# EAGLE design power-v3 (EAGLE 5.11)
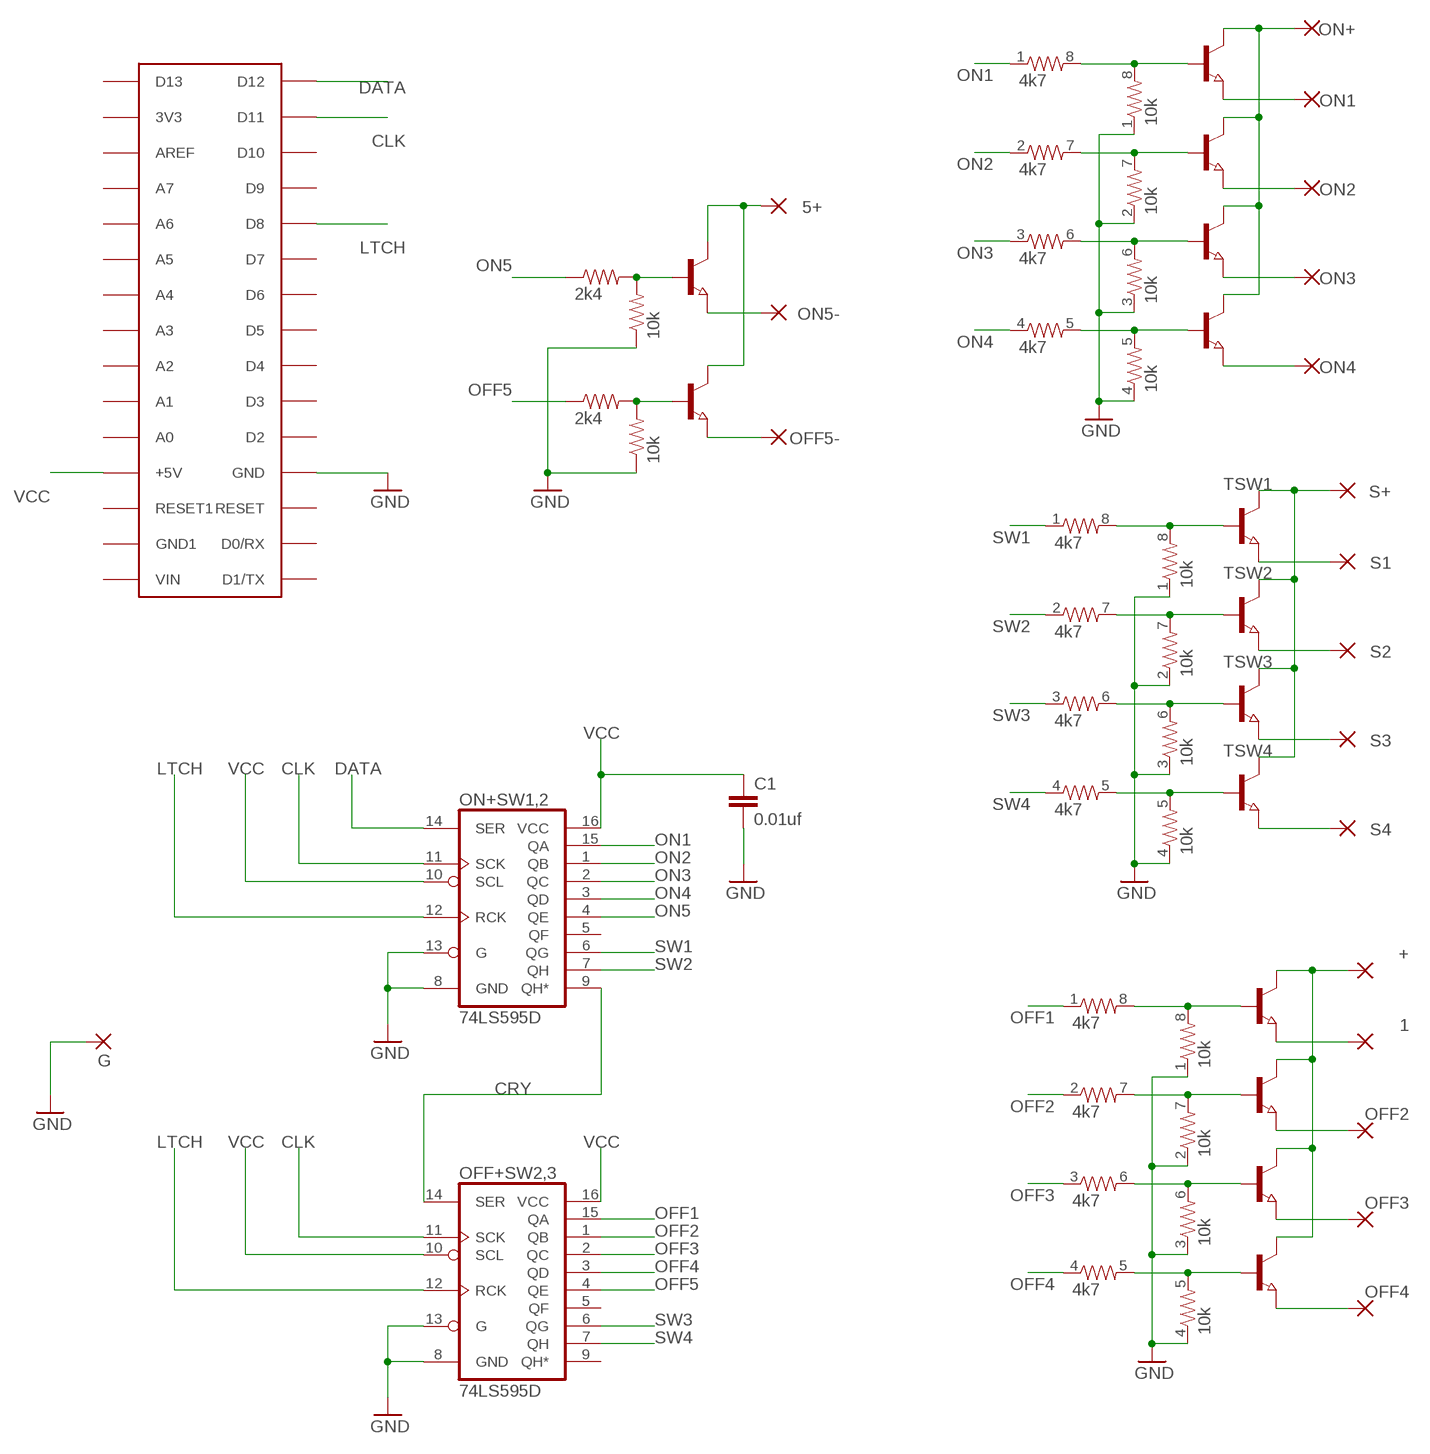
[diagram p0: schematic, sheet 1]

## Parts
1  1,6/0,8  [1,6/0,8]
5+  1,6/0,8  [1,6/0,8]
+  1,6/0,8  [1,6/0,8]
C1  0.01uf  CAP0603-CAP  [0603-CAP]
G  1,6/0,8  [1,6/0,8]
NANO  ARDUINONANO  [PDIP-32]
OFF2  1,6/0,8  [1,6/0,8]
OFF3  1,6/0,8  [1,6/0,8]
OFF4  1,6/0,8  [1,6/0,8]
OFF5-  1,6/0,8  [1,6/0,8]
OFF+SW2,3  74LS595D  [SO16]
ON1  1,6/0,8  [1,6/0,8]
ON2  1,6/0,8  [1,6/0,8]
ON3  1,6/0,8  [1,6/0,8]
ON4  1,6/0,8  [1,6/0,8]
ON5-  1,6/0,8  [1,6/0,8]
ON+  1,6/0,8  [1,6/0,8]
ON+SW1,2  74LS595D  [SO16]
R1  4k7  RESISTOR-ARRAY0603-ARV  [0603-ARV]
R2  10k  RESISTOR-ARRAY0603-ARV  [0603-ARV]
R3  2k4  RESISTOR0603-RES  [0603-RES]
R18  2k4  RESISTOR0603-RES  [0603-RES]
R19  10k  RESISTOR0603-RES  [0603-RES]
R20  10k  RESISTOR0603-RES  [0603-RES]
R21  4k7  RESISTOR-ARRAY0603-ARV  [0603-ARV]
R22  10k  RESISTOR-ARRAY0603-ARV  [0603-ARV]
R23  4k7  RESISTOR-ARRAY0603-ARV  [0603-ARV]
R24  10k  RESISTOR-ARRAY0603-ARV  [0603-ARV]
S1  1,6/0,8  [1,6/0,8]
S2  1,6/0,8  [1,6/0,8]
S3  1,6/0,8  [1,6/0,8]
S4  1,6/0,8  [1,6/0,8]
S+  1,6/0,8  [1,6/0,8]
TOFF1  NPN-TRANSISTOR_SOT23  [SOT23]
TOFF2  NPN-TRANSISTOR_SOT23  [SOT23]
TOFF3  NPN-TRANSISTOR_SOT23  [SOT23]
TOFF4  NPN-TRANSISTOR_SOT23  [SOT23]
TOFF5  NPN-TRANSISTOR_SOT23  [SOT23]
TON1  NPN-TRANSISTOR_SOT23  [SOT23]
TON2  NPN-TRANSISTOR_SOT23  [SOT23]
TON3  NPN-TRANSISTOR_SOT23  [SOT23]
TON4  NPN-TRANSISTOR_SOT23  [SOT23]
TON5  NPN-TRANSISTOR_SOT23  [SOT23]
TSW1  NPN-TRANSISTOR_SOT23  [SOT23]
TSW2  NPN-TRANSISTOR_SOT23  [SOT23]
TSW3  NPN-TRANSISTOR_SOT23  [SOT23]
TSW4  NPN-TRANSISTOR_SOT23  [SOT23]

## Nets
CLK: NANO.D11 OFF+SW2,3.11(SCK) ON+SW1,2.11(SCK)
CRY: OFF+SW2,3.14(SER) ON+SW1,2.9(QH*)
DATA: NANO.D12 ON+SW1,2.14(SER)
GND: C1.2 G.1(P) NANO.GND OFF+SW2,3.8(GND) OFF+SW2,3.13(G) ON+SW1,2.8(GND) ON+SW1,2.13(G) R2.1 R2.2 R2.3 R2.4 R19.1 R20.1 R22.1 R22.2 R22.3 R22.4 R24.1 R24.2 R24.3 R24.4
LTCH: NANO.D8 OFF+SW2,3.12(RCK) ON+SW1,2.12(RCK)
N$1: +.1(P) TOFF1.3(C) TOFF2.3(C) TOFF3.3(C) TOFF4.3(C)
N$2: 1.1(P) TOFF1.2(E)
N$3: OFF2.1(P) TOFF2.2(E)
N$4: OFF3.1(P) TOFF3.2(E)
N$5: 5+.1(P) TOFF5.3(C) TON5.3(C)
N$6: OFF4.1(P) TOFF4.2(E)
N$7: S+.1(P) TSW1.3(C) TSW2.3(C) TSW3.3(C) TSW4.3(C)
N$8: S1.1(P) TSW1.2(E)
N$9: S2.1(P) TSW2.2(E)
N$10: S3.1(P) TSW3.2(E)
N$11: ON5-.1(P) TON5.2(E)
N$12: S4.1(P) TSW4.2(E)
N$23: ON+.1(P) TON1.3(C) TON2.3(C) TON3.3(C) TON4.3(C)
N$24: ON1.1(P) TON1.2(E)
N$25: ON2.1(P) TON2.2(E)
N$29: ON3.1(P) TON3.2(E)
N$30: ON4.1(P) TON4.2(E)
N$31: OFF5-.1(P) TOFF5.2(E)
OFF1: OFF+SW2,3.15(QA) R1.1
OFF2: OFF+SW2,3.1(QB) R1.2
OFF3: OFF+SW2,3.2(QC) R1.3
OFF4: OFF+SW2,3.3(QD) R1.4
OFF5: OFF+SW2,3.4(QE) R18.1 R18.2 R20.2 TOFF5.1(B)
ON1: ON+SW1,2.15(QA) R23.1
ON2: ON+SW1,2.1(QB) R23.2
ON3: ON+SW1,2.2(QC) R23.3
ON4: ON+SW1,2.3(QD) R23.4
ON5: ON+SW1,2.4(QE) R3.1 R3.2 R19.2 TON5.1(B)
SW1: ON+SW1,2.6(QG) R1.8 R2.8 R21.1 R21.8 R22.8 R23.8 R24.8 TOFF1.1(B) TON1.1(B) TSW1.1(B)
SW2: ON+SW1,2.7(QH) R1.7 R2.7 R21.2 R21.7 R22.7 R23.7 R24.7 TOFF2.1(B) TON2.1(B) TSW2.1(B)
SW3: OFF+SW2,3.6(QG) R1.6 R2.6 R21.3 R21.6 R22.6 R23.6 R24.6 TOFF3.1(B) TON3.1(B) TSW3.1(B)
SW4: OFF+SW2,3.7(QH) R1.5 R2.5 R21.4 R21.5 R22.5 R23.5 R24.5 TOFF4.1(B) TON4.1(B) TSW4.1(B)
VCC: C1.1 NANO.+5V OFF+SW2,3.10(SCL) OFF+SW2,3.16(VCC) ON+SW1,2.10(SCL) ON+SW1,2.16(VCC)
Unconnected: NANO.3V3 NANO.A0 NANO.A1 NANO.A2 NANO.A3 NANO.A4 NANO.A5 NANO.A6 NANO.A7 NANO.AREF NANO.D0/RX NANO.D1/TX NANO.D2 NANO.D3 NANO.D4 NANO.D5 NANO.D6 NANO.D7 NANO.D9 NANO.D10 NANO.D13 NANO.GND1 NANO.RESET NANO.RESET1 NANO.VIN OFF+SW2,3.5(QF) OFF+SW2,3.9(QH*) ON+SW1,2.5(QF)

## Library data of the parts
1 5+ + G OFF2-OFF4 OFF5- ON1-ON4 ON5- ON+ S1-S4 S+ = wirepad:1,6/0,8: THROUGH-HOLE PAD
C1 = SparkFun:CAP: Capacitor Standard 0603 ceramic capacitor, and 0.1" leaded capacitor.
NANO = MyNano:ARDUINONANO
OFF+SW2,3 ON+SW1,2 = SparkFun:74*595: 8-bit SHIFT REGISTER, output latch
R1 R2 R21-R24 = SparkFun:RESISTOR-ARRAY: Array Chip Resistor Source: RS Component / Phycomp
R3 R18-R20 = SparkFun:RESISTOR: Resistor Basic schematic elements and footprints for 0603, 1206, and PTH resistors.
TOFF1-TOFF5 TON1-TON5 TSW1-TSW4 = semicon-smd-ipc:NPN-TRANSISTOR_: NPN TRANSISTOR

## Net classes
0 default: width 0.305 mm, clearance 0.305 mm

## Board
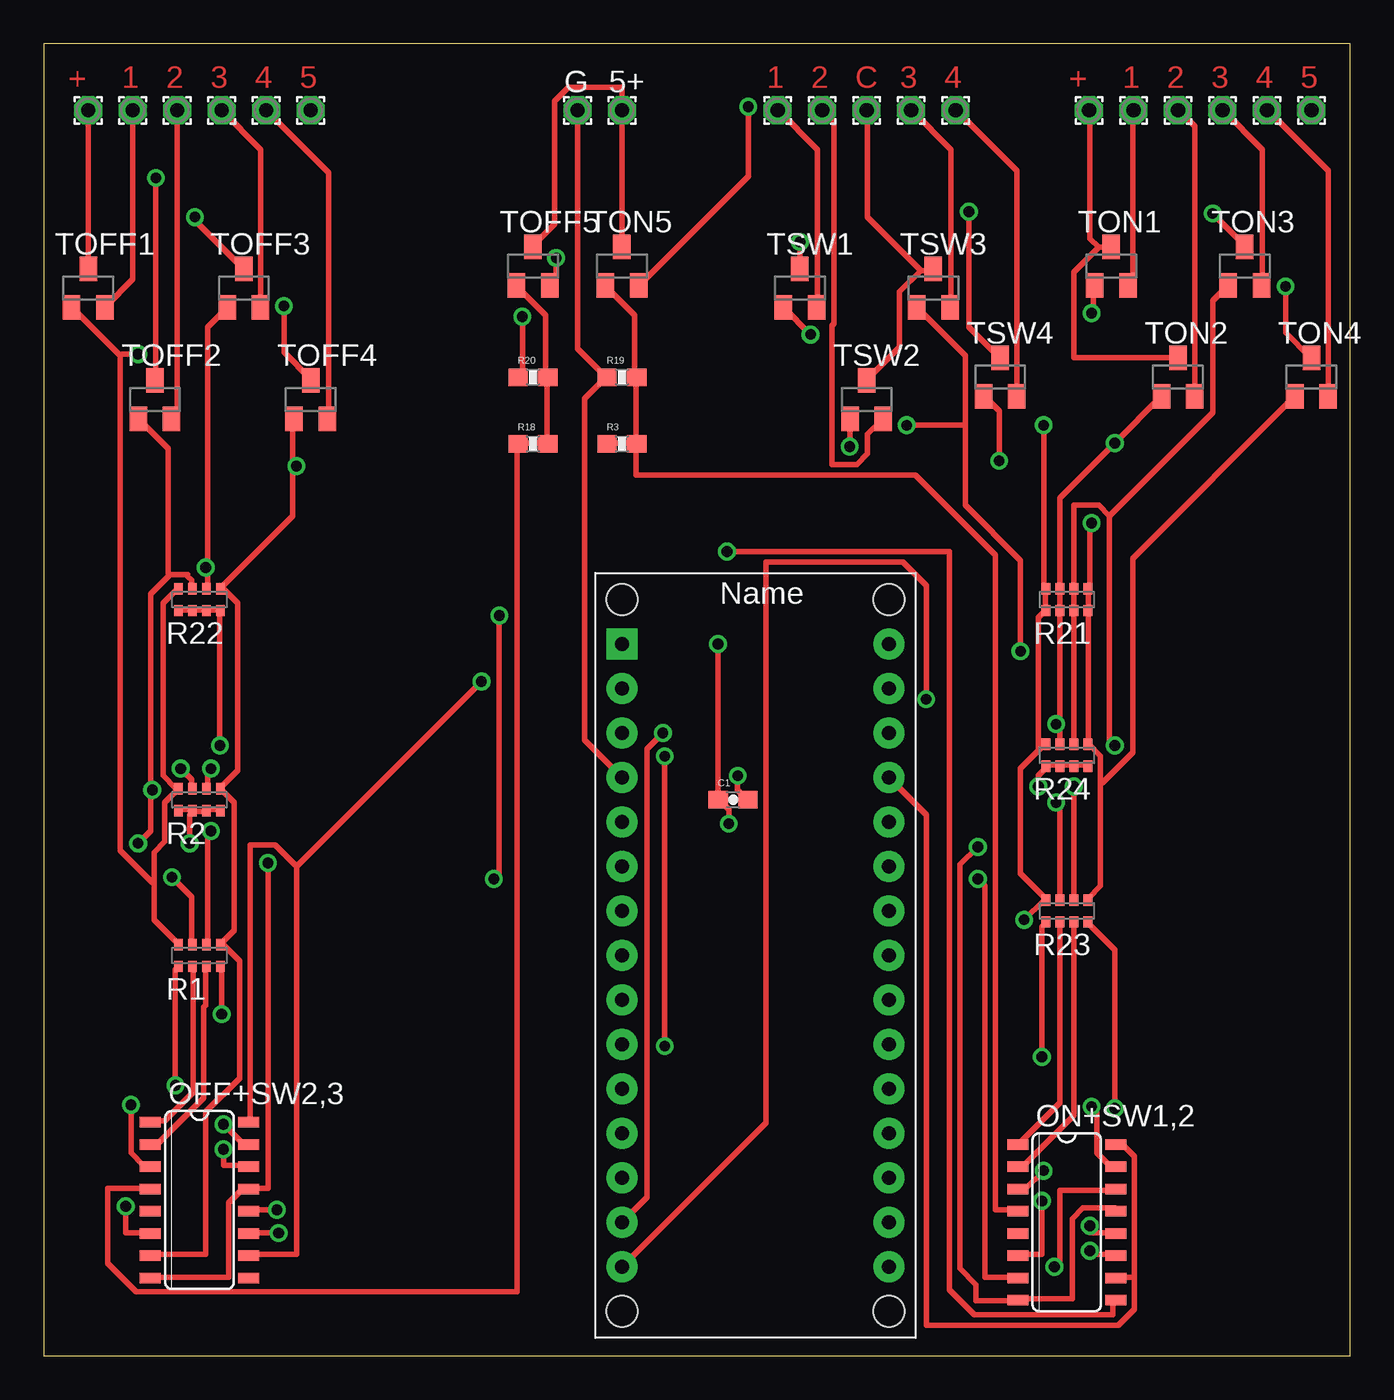
[diagram p1: board, top side]
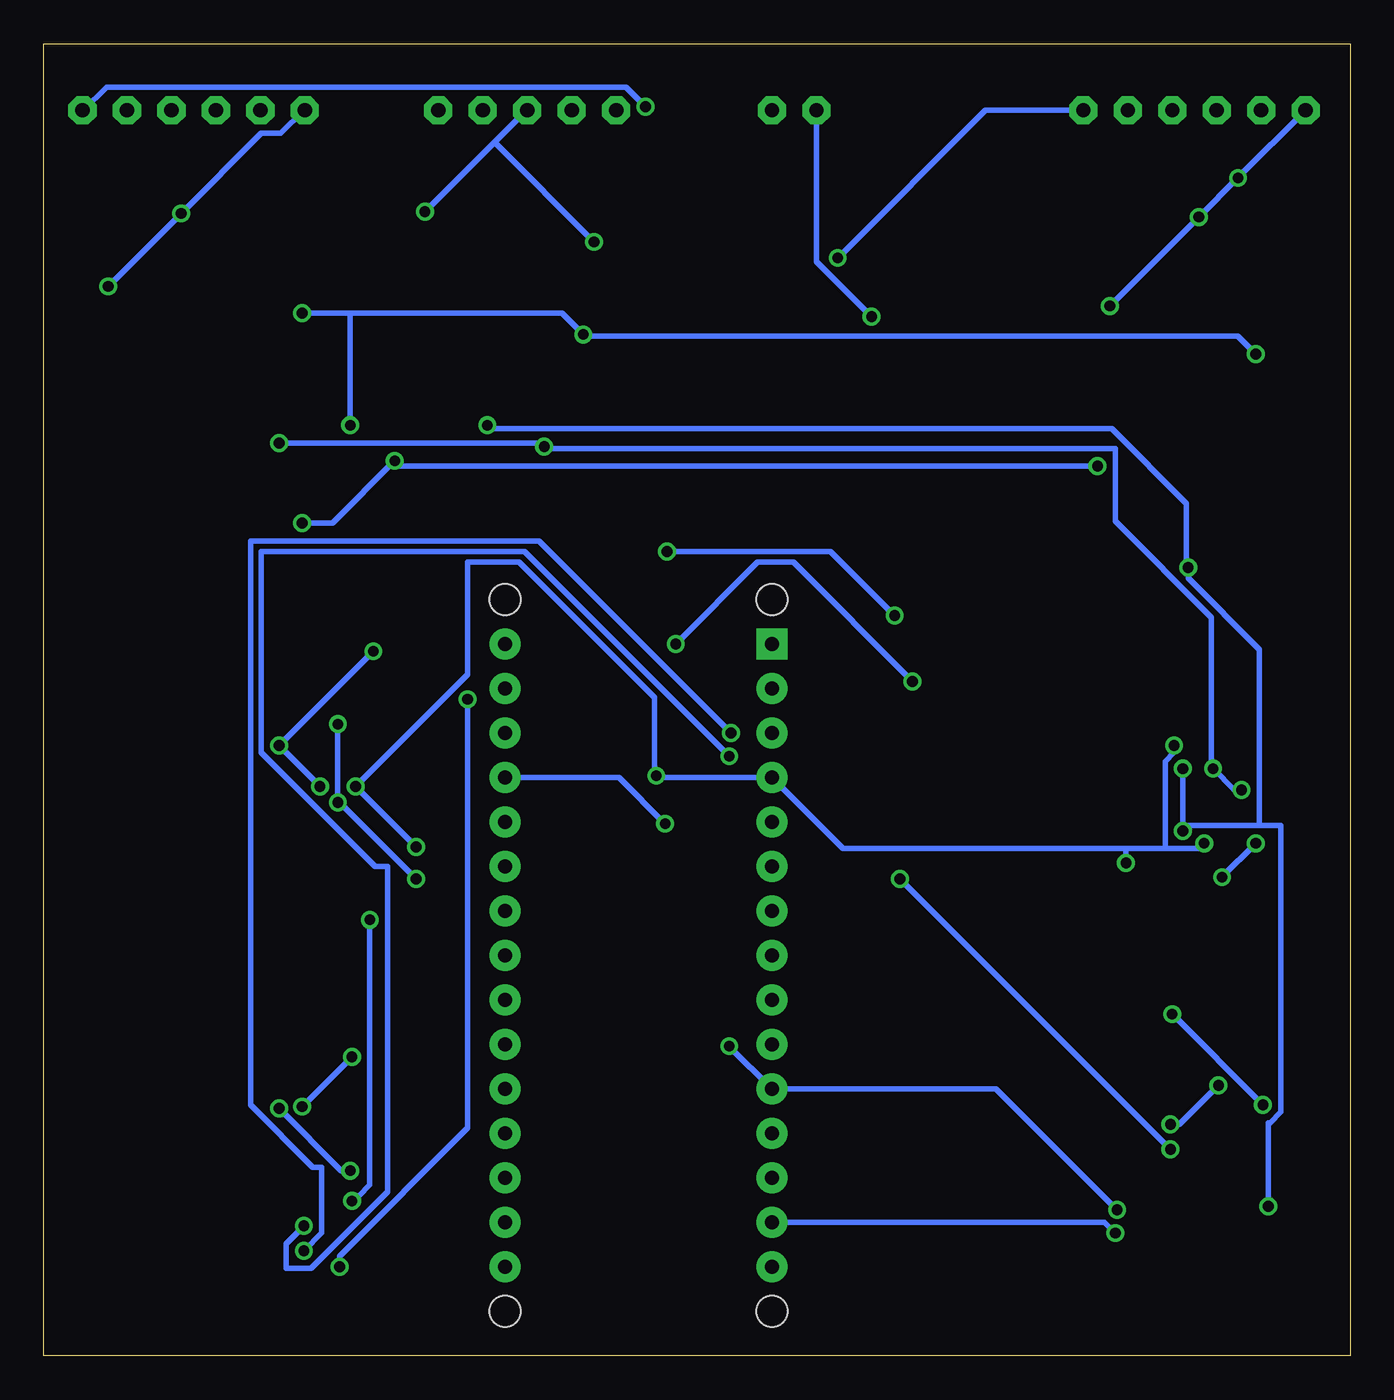
[diagram p2: board, bottom side, seen from below]

Size 74.6 x 74.92 mm. Coordinates in mm from the lower left corner, seen from the top.
Outline: 0,0 74.6,0 74.6,74.92 0,74.92 0,0
Copper layers (1*16): Top 0.035mm / dielectric 1.5mm / Bottom 0.035mm
Design rules "default": minimum track width 10mil, minimum drill 24mil, track to track 8mil, track to pad 8mil, pad to pad 8mil, via to via 8mil, smd to smd 8mil, copper to edge 40mil, drill to drill 8mil, minimum pad ring 10mil, minimum via ring 8mil, stop-mask expansion 4mil, vias tented up to drill 0mil, thermal gap 10mil

### Footprints (pad centres in the part's own frame; a part is rotated, then mirrored left to right if it is on the bottom)
1,6/0,8 = drill 0.813 pad 1.6 octagon: 1 0,0
0603-CAP = smd 1.1 x 1: 1 -0.85,0; 2 0.85,0
PDIP-32 = drill 0.8 pad 1.778 round: 3V3 15.24,-35.56; +5V 15.24,-10.16; A0 15.24,-12.7; A1 15.24,-15.24; A2 15.24,-17.78; A3 15.24,-20.32; A4 15.24,-22.86; A5 15.24,-25.4; A6 15.24,-27.94; A7 15.24,-30.48; AREF 15.24,-33.02; D0/RX 0,-5.08; D2 0,-12.7; D3 0,-15.24; D4 0,-17.78; D5 0,-20.32; D6 0,-22.86; D7 0,-25.4; D8 0,-27.94; D9 0,-30.48; D10 0,-33.02; D11 0,-35.56; D12 0,-38.1; D13 15.24,-38.1; GND 0,-10.16; GND1 15.24,-5.08; RESET 0,-7.62; RESET1 15.24,-7.62; VIN 15.24,-2.54 | drill 0.8 pad 1.778 square: D1/TX 0,-2.54 | hole 1.778: 0,0; 0,-40.64; 15.24,-40.64; 15.24,0
SO16 = smd 0.6 x 1.2: 1 -4.445,-2.8; 2 -3.175,-2.8; 3 -1.905,-2.8; 4 -0.635,-2.8; 5 0.635,-2.8; 6 1.905,-2.8; 7 3.175,-2.8; 8 4.445,-2.8; 9 4.445,2.8; 10 3.175,2.8; 11 1.905,2.8; 12 0.635,2.8; 13 -0.635,2.8; 14 -1.905,2.8; 15 -3.175,2.8; 16 -4.445,2.8
0603-ARV = smd 0.5 x 0.65: 1 -1.2,-0.625; 2 -0.4,-0.625; 3 0.4,-0.625; 4 1.2,-0.625; 5 1.2,0.625; 6 0.4,0.625; 7 -0.4,0.625; 8 -1.2,0.625
0603-RES = smd 1.1 x 1: 1 -0.85,0; 2 0.85,0
SOT23 = smd 1 x 1.4: 1 -0.95,-1.1; 2 0.95,-1.1; 3 0,1.1

### Placement (x,y rotation side)
1  5.08,71.12 0 top
5+  33.02,71.12 0 top
+  2.54,71.12 0 top
C1  39.37,31.75 0 top
G  30.48,71.12 0 top
NANO  33.02,43.18 0 top
OFF2  7.62,71.12 0 top
OFF3  10.16,71.12 0 top
OFF4  12.7,71.12 0 top
OFF5-  15.24,71.12 0 top
OFF+SW2,3  8.89,8.89 270 top
ON1  62.23,71.12 0 top
ON2  64.77,71.12 0 top
ON3  67.31,71.12 0 top
ON4  69.85,71.12 0 top
ON5-  72.39,71.12 0 top
ON+  59.69,71.12 0 top
ON+SW1,2  58.42,7.62 270 top
R1  8.89,22.86 0 top
R2  8.89,31.75 0 top
R3  33.02,52.07 0 top
R18  27.94,52.07 0 top
R19  33.02,55.88 0 top
R20  27.94,55.88 0 top
R21  58.42,43.18 0 top
R22  8.89,43.18 0 top
R23  58.42,25.4 0 top
R24  58.42,34.29 0 top
S1  41.91,71.12 0 top
S2  44.45,71.12 0 top
S3  49.53,71.12 0 top
S4  52.07,71.12 0 top
S+  46.99,71.12 0 top
TOFF1  2.54,60.96 0 top
TOFF2  6.35,54.61 0 top
TOFF3  11.43,60.96 0 top
TOFF4  15.24,54.61 0 top
TOFF5  27.94,62.23 0 top
TON1  60.96,62.23 0 top
TON2  64.77,55.88 0 top
TON3  68.58,62.23 0 top
TON4  72.39,55.88 0 top
TON5  33.02,62.23 0 top
TSW1  43.18,60.96 0 top
TSW2  46.99,54.61 0 top
TSW3  50.8,60.96 0 top
TSW4  54.61,55.88 0 top

### Tracks (layer width: path | path; a pad name or v marks a point on that pad's centre or on a via)
CLK  (via drill 0.61)
  Top 0.305: v13.41,7.01 11.79,7.01 OFF+SW2,3.11 | v59.74,5.99 59.74,5.79 61.16,5.79 ON+SW1,2.11 | v35.36,35.56 34.44,34.65 34.44,9.04 NANO.D11
  Bottom 0.305: v13.41,7.01 14.02,7.62 NANO.D11 | v59.74,5.99 58.73,7.01 58.73,10.77 59.23,10.77 62.79,14.33 62.79,46.53 46.33,46.53 v35.36,35.56
CRY  (via drill 0.61)
  Top 0.305: v10.26,11.79 10.26,10.87 11.68,10.87 OFF+SW2,3.14 | v25.7,27.23 26.01,27.53 v26.01,42.27 | v39.01,45.92 51.71,45.92 51.71,3.76 53.14,2.34 61.06,2.34 61.06,3.05 61.16,3.15 ON+SW1,2.9
  Bottom 0.305: v10.26,11.79 v25.7,27.23 | v26.01,42.27 29.67,45.92 v39.01,45.92
DATA  (via drill 0.61)
  Top 0.305: v57.71,5.08 58.01,5.38 58.01,9.45 61.16,9.45 ON+SW1,2.14 | v50.39,37.49 50.39,43.99 49.07,45.31 41.25,45.31 41.25,13.31 NANO.D12
  Bottom 0.305: v57.71,5.08 57.71,5.69 50.39,13.01 v50.39,37.49
GND  (via drill 0.61)
  Top 0.305: v27.33,59.33 27.33,56.08 27.13,55.88 R20.1 | G.1 30.48,57.51 32.11,55.88 R19.1 32,55.78 30.89,54.66 30.89,35.15 NANO.GND | ON+SW1,2.13 61.16,8.33 61.16,8.43 59.33,8.43 58.73,7.82 58.73,3.25 55.68,3.25 ON+SW1,2.8 55.47,3.15 53.24,3.15 53.24,4.06 52.32,4.98 52.32,28.04 v53.34,29.06 | OFF+SW2,3.8 6.1,4.47 10.57,4.47 10.57,8.74 11.28,9.45 11.68,9.45 OFF+SW2,3.13 11.79,9.55 12.8,9.55 v12.8,28.14 | R24.4 59.54,33.73 58.93,33.73 R24.3 58.73,33.73 58.12,33.73 R24.2 58.01,33.73 57.3,33.73 R24.1 57.2,33.53 56.79,33.12 v56.79,32.51 | R22.1 7.72,42.57 8.43,42.57 R22.2 8.64,42.57 9.25,42.57 R22.3 9.45,42.57 10.06,42.57 R22.4 10.06,42.47 v10.06,34.85 | R2.1 7.72,31.19 8.43,31.19 R2.2 | R2.2 8.64,31.09 9.25,31.09 R2.3 9.35,31.19 10.06,31.19 R2.4 | v39.62,33.12 39.62,32.31 40.13,31.8 C1.2 | v8.33,29.26 8.33,30.89 8.43,30.99 R2.2
  Bottom 0.305: v27.33,59.33 30.48,62.48 G.1 | v8.33,29.26 8.64,28.96 10.57,28.96 | 12.8,28.96 28.96,28.96 NANO.GND 39.52,33.02 v39.62,33.12 39.73,33.22 39.73,37.59 47.45,45.31 50.39,45.31 50.39,38.91 v56.79,32.51 v53.34,29.06 | 12.8,28.96 10.57,28.96 | v10.06,34.85 10.06,34.44 10.57,33.93 10.57,28.96 | v12.8,28.14 12.8,28.96
LTCH  (via drill 0.61)
  Top 0.305: v13.31,8.33 11.79,8.33 OFF+SW2,3.12 | v59.74,7.42 59.74,7.01 61.16,7.01 ON+SW1,2.12 | v35.46,17.68 v35.46,34.24
  Bottom 0.305: v13.31,8.33 20.22,15.24 NANO.D8 v35.46,17.68 | v59.74,7.42 60.76,6.4 60.76,4.98 59.33,4.98 54.97,9.35 54.97,27.94 55.68,27.94 62.18,34.44 62.18,45.92 47.14,45.92 v35.46,34.24
N$1  (via drill 0.61)
  Top 0.305: +.1 TOFF1.3 | v6.4,67.26 6.4,55.78 TOFF2.3 | v8.64,65.02 8.64,64.82 11.38,62.08 TOFF3.3 | v13.72,59.94 13.72,57.3 15.24,55.78 TOFF4.3
  Bottom 0.305: +.1 v6.4,67.26 v8.64,65.02 v13.72,59.94
N$2
  Top 0.305: 1.1 5.08,61.47 3.56,59.94 TOFF1.2
N$3
  Top 0.305: OFF2.1 7.62,53.85 7.32,53.54 TOFF2.2
N$4
  Top 0.305: OFF3.1 12.39,68.89 12.39,59.94 TOFF3.2
N$5
  Top 0.305: TOFF5.3 27.94,63.4 29.16,64.62 29.16,71.63 29.97,72.44 33.02,72.44 5+.1 TON5.3
N$6
  Top 0.305: OFF4.1 16.26,67.56 16.26,53.54 TOFF4.2
N$7  (via drill 0.61)
  Top 0.305: 50.09,61.98 48.87,60.76 48.87,57.61 47.04,55.78 TSW2.3 | 50.09,61.98 50.8,61.98 TSW3.3 | v52.83,65.33 52.83,58.73 54.56,57 TSW4.3 | v43.18,63.6 TSW1.3 | 50.09,61.98 47.04,65.02 47.04,71.12 S+.1
  Bottom 0.305: 48.87,69.29 47.04,71.12 S+.1 | 48.87,69.29 v52.83,65.33 | 48.87,69.29 v43.18,63.6
N$8
  Top 0.305: TSW1.2 44.2,59.94 44.2,68.89 41.96,71.12 S1.1
N$9
  Top 0.305: TSW2.2 47.85,53.44 47.04,52.63 47.04,51.51 46.43,50.9 45.01,50.9 45.01,58.83 45.11,58.93 45.11,70.51 44.5,71.12 S2.1
N$10
  Top 0.305: TSW3.2 51.82,59.94 51.82,68.89 49.58,71.12 S3.1
N$11  (via drill 0.61)
  Top 0.305: v40.23,71.32 40.23,67.36 34.04,61.16 TON5.2
  Bottom 0.305: v40.23,71.32 41.35,72.44 71.02,72.44 72.34,71.12 ON5-.1
N$12
  Top 0.305: TSW4.2 55.58,54.86 55.58,67.67 52.12,71.12 S4.1
N$23  (via drill 0.61)
  Top 0.305: 60.25,63.3 58.83,61.87 58.83,57 64.72,57 TON2.3 | 60.25,63.3 60.96,63.3 TON1.3 | v66.75,65.23 68.58,63.4 TON3.3 | v70.92,61.06 70.92,58.42 72.34,57 TON4.3 | 60.25,63.3 59.74,63.8 59.74,71.12 ON+.1
  Bottom 0.305: ON+.1 59.74,71.12 61.06,69.8 62.18,69.8 v66.75,65.23 v70.92,61.06
N$24
  Top 0.305: TON1.2 61.98,61.16 62.18,61.37 62.18,71.12 ON1.1
N$25
  Top 0.305: TON2.2 65.73,54.86 65.73,70.21 64.82,71.12 ON2.1
N$29
  Top 0.305: TON3.2 69.6,61.16 69.6,68.89 67.36,71.12 ON3.1
N$30
  Top 0.305: TON4.2 73.36,54.86 73.36,67.67 69.9,71.12 ON4.1
N$31  (via drill 0.61)
  Top 0.305: v29.26,62.69 29.26,61.47 28.96,61.16 TOFF5.2
  Bottom 0.305: v29.26,62.69 20.83,71.12 OFF5-.1
OFF1  (via drill 0.61)
  Top 0.305: v7.52,15.44 7.52,22.05 7.62,22.15 R1.1 | v10.26,13.21 11.38,12.09 11.68,12.09 OFF+SW2,3.15
  Bottom 0.305: v7.52,15.44 9.75,13.21 v10.26,13.21
OFF2
  Top 0.305: R1.2 8.53,22.15 8.53,15.04 6.91,13.41 6.1,13.41 OFF+SW2,3.1
OFF3
  Top 0.305: R1.3 9.25,22.15 9.25,20.02 9.14,19.91 9.14,14.73 6.5,12.09 6.1,12.09 OFF+SW2,3.2
OFF4  (via drill 0.61)
  Top 0.305: v10.16,19.51 10.16,22.15 R1.4 | v4.98,14.33 4.98,11.58 5.69,10.87 5.99,10.87 OFF+SW2,3.3
  Bottom 0.305: v4.98,14.33 v10.16,19.51
OFF5
  Top 0.305: OFF+SW2,3.4 5.99,9.55 3.66,9.55 3.66,5.28 5.28,3.66 27.03,3.66 27.03,52.02 R18.1 27.13,52.12 28.75,52.12 R18.2 28.75,52.22 28.75,55.88 R20.2 28.65,55.98 28.65,59.44 27.03,61.06 TOFF5.1
ON1  (via drill 0.61)
  Top 0.305: v57,17.07 57,24.49 57.2,24.69 R23.1 | v59.84,14.22 60.15,13.92 60.15,11.58 60.86,10.87 61.16,10.87 ON+SW1,2.15
  Bottom 0.305: v59.84,14.22 v57,17.07
ON2
  Top 0.305: R23.2 58.01,24.69 58.01,14.43 55.68,12.09 ON+SW1,2.1
ON3
  Top 0.305: R23.3 58.83,24.69 58.83,13.72 55.98,10.87 55.68,10.87 ON+SW1,2.2
ON4  (via drill 0.61)
  Top 0.305: v61.16,14.12 61.16,23.16 59.64,24.69 R23.4 | v57.1,10.57 56.08,9.55 55.68,9.55 ON+SW1,2.3
  Bottom 0.305: v61.16,14.12 57.61,10.57 v57.1,10.57
ON5
  Top 0.305: R3.1 32.21,52.12 33.83,52.12 R3.2 | R3.2 33.83,52.22 33.83,55.88 R19.2 33.73,55.98 33.73,59.44 32.11,61.06 TON5.1 | ON+SW1,2.4 55.58,8.33 54.36,8.33 54.36,45.72 49.78,50.29 33.83,50.29 33.83,51.92 R3.2
SW1  (via drill 0.61)
  Top 0.305: 6.3,27.03 6.3,28.75 6.91,29.36 6.91,31.6 7.62,32.31 R2.8 7.52,32.41 6.81,33.12 6.81,42.98 7.62,43.79 R22.8 | 6.3,27.03 6.3,24.89 7.62,23.57 R1.8 | 4.37,57.1 1.63,59.84 TOFF1.1 | 4.37,57.1 4.37,28.85 6.2,27.03 6.3,27.03 | v43.79,58.32 42.27,59.84 TSW1.1 | v59.84,59.54 59.94,59.64 59.94,61.06 TON1.1 | 56.9,34.65 57.2,34.95 R24.8 | 56.9,34.65 55.78,33.53 55.78,27.53 57.2,26.11 R23.8 57.1,26.01 v55.98,24.89 | 56.9,34.65 56.79,34.75 56.79,42.16 57.1,42.47 R21.1 57.2,42.57 57.2,43.79 R21.8 57.1,43.89 v57.1,53.14 | v57,8.84 57,5.79 55.68,5.79 ON+SW1,2.6 | v5.38,57.2 4.47,57.2 4.37,57.1
  Bottom 0.305: 57.1,59.54 v59.84,59.54 | 57.1,59.54 45.01,59.54 v43.79,58.32 43.69,58.22 6.4,58.22 v5.38,57.2 | v57,8.84 56.69,9.14 56.59,9.14 55.98,9.75 v55.98,24.89 | 57.1,59.54 v57.1,53.14
SW2  (via drill 0.61)
  Top 0.305: v7.32,27.33 8.43,26.21 8.43,23.57 R1.7 | v5.38,29.26 6.1,29.97 6.1,32.31 | 6.1,32.31 6.1,43.48 7.21,44.6 | 7.21,44.6 8.23,44.6 8.23,44.5 8.43,44.3 8.43,43.89 R22.7 | v7.82,33.53 8.43,32.92 8.43,32.41 R2.7 | 6.1,32.31 v6.2,32.31 | TOFF2.1 5.49,53.44 7.11,51.82 7.11,44.7 7.21,44.6 | v46.02,51.92 46.02,53.44 TSW2.1 | TON2.1 63.8,54.76 v61.16,52.12 58.01,48.97 58.01,43.89 R21.7 58.01,42.57 R21.2 58.01,42.47 58.01,36.07 v57.81,36.07 58.01,35.87 58.01,34.95 R24.7 | v57.81,31.6 58.01,31.39 58.01,26.11 R23.7 | v53.34,27.23 53.75,26.82 53.75,4.47 55.58,4.47 ON+SW1,2.7
  Bottom 0.305: v7.32,27.33 v5.38,29.26 | v6.2,32.31 6.6,32.31 v7.82,33.53 7.92,33.63 7.92,42.16 13.41,47.65 13.41,51.82 45.92,51.82 v46.02,51.92 46.23,52.12 v61.16,52.12 | v57.81,36.07 v57.81,31.6 57.71,31.5 57.61,31.5 v53.34,27.23
SW3  (via drill 0.61)
  Top 0.305: R24.6 58.83,34.95 58.83,42.47 R21.3 58.83,42.67 58.83,43.69 R21.6 58.83,43.89 58.83,48.56 60.25,48.56 60.86,47.95 | v58.83,32.51 58.83,26.11 R23.6 | v61.16,34.85 60.86,35.15 60.86,47.95 | 52.63,53.14 52.63,48.56 55.78,45.41 v55.78,40.23 | 52.63,53.14 52.63,57.1 49.89,59.84 TSW3.1 | TON3.1 67.56,61.06 66.75,60.25 66.75,53.85 60.86,47.95 | 9.35,45.01 9.35,58.73 10.46,59.84 TOFF3.1 | 9.35,45.01 9.35,43.89 R22.6 | v9.55,29.97 9.35,29.77 9.35,23.57 R1.6 | v9.55,33.53 9.35,33.33 9.35,32.41 R2.6 | v4.67,8.53 4.67,7.01 5.99,7.01 OFF+SW2,3.6 | v9.25,45.01 9.35,45.01 | v49.28,53.14 52.63,53.14
  Bottom 0.305: v58.83,32.51 v61.16,34.85 v55.78,40.23 | v9.55,33.53 v9.55,29.97 9.45,30.28 5.18,30.28 | v4.67,8.53 4.67,13.31 4.57,13.31 3.96,13.92 3.96,30.28 5.18,30.28 | 5.18,30.28 5.18,40.34 9.25,44.4 v9.25,45.01 9.35,45.11 9.35,48.67 13.61,52.93 49.07,52.93 v49.28,53.14
SW4  (via drill 0.61)
  Top 0.305: 60.35,32.72 60.35,34.24 59.64,34.95 R24.5 59.64,35.05 59.64,42.47 R21.4 59.64,42.57 59.64,43.79 R21.5 59.74,43.89 59.74,47.45 v59.84,47.55 | 60.35,32.72 60.35,26.82 59.64,26.11 R23.5 | v54.56,51.1 54.56,53.95 53.75,54.76 TSW4.1 | TON4.1 71.42,54.76 62.18,45.52 62.18,34.44 60.45,32.72 60.35,32.72 | 14.22,50.8 14.22,53.44 TOFF4.1 | 14.22,50.8 14.22,47.95 10.16,43.89 R22.5 10.26,43.79 11.07,42.98 11.07,33.43 10.16,32.51 R2.5 10.16,32.31 10.87,31.6 10.87,24.28 10.16,23.57 R1.5 10.26,23.47 11.18,22.55 11.18,15.85 9.25,13.92 9.25,5.79 6.1,5.79 OFF+SW2,3.7 | 14.22,50.8 v14.43,50.8
  Bottom 0.305: v59.84,47.55 58.12,47.55 v54.56,51.1 54.25,50.8 v14.43,50.8
VCC  (via drill 0.61)
  Top 0.305: 14.43,27.94 14.43,5.79 11.79,5.79 OFF+SW2,3.10 | 14.43,27.94 13.21,29.16 11.79,29.16 11.79,13.41 OFF+SW2,3.16 | 62.28,4.47 61.27,4.47 ON+SW1,2.10 | 62.28,4.47 62.28,11.38 61.67,11.99 61.27,11.99 ON+SW1,2.16 | v39.12,30.38 39.12,31.19 38.61,31.7 C1.1 38.51,31.9 v38.51,40.64 | NANO.+5V 50.39,30.89 50.39,1.73 61.37,1.73 62.28,2.64 62.28,4.47 | 14.43,27.94 v24.99,38.51
  Bottom 0.305: v39.12,30.38 41.76,33.02 NANO.+5V | v24.99,38.51 31.8,45.31 33.83,45.31 v38.51,40.64

### Text on the board
Top: C | + | 1 | 2 | 3 | 4 | 5 | 1 | 2 | 3 | 4 | + | 1 | 2 | 3 | 4 | 5